# Altium schematic sheet 1Teclado_Prueba.SchDoc
size A4
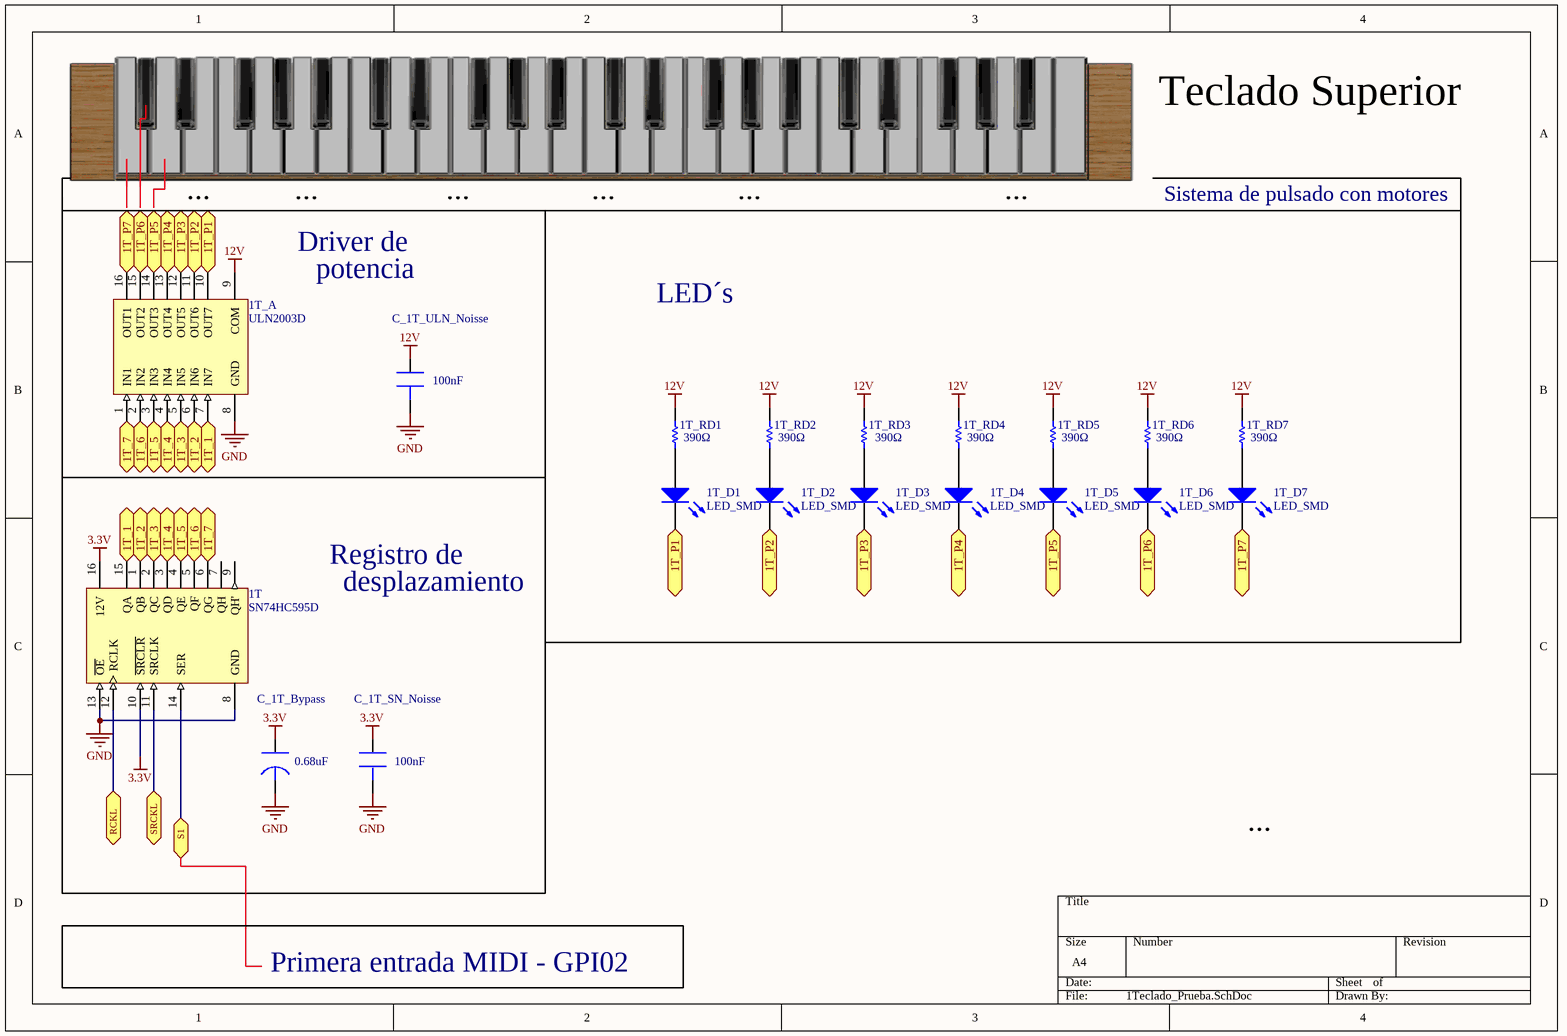
[diagram p0: 1Teclado_Prueba.SchDoc]

## Parts
1T  SN74HC595D  [SN74HC595D]
1T_A  ULN2003D  [ULN2003AI]
1T_D1  LED_SMD  [LED_0805]
1T_D2  LED_SMD  [LED_0805]
1T_D3  LED_SMD  [LED_0805]
1T_D4  LED_SMD  [LED_0805]
1T_D5  LED_SMD  [LED_0805]
1T_D6  LED_SMD  [LED_0805]
1T_D7  LED_SMD  [LED_0805]
1T_RD1  value 390Ω  [Resistencia_0805_N]  (hidden comment: Res Chip 0805)
1T_RD2  value 390Ω  [Resistencia_0805_N]  (hidden comment: Res Chip 0805)
1T_RD3  value 390Ω  [Resistencia_0805_N]  (hidden comment: Res Chip 0805)
1T_RD4  value 390Ω  [Resistencia_0805_N]  (hidden comment: Res Chip 0805)
1T_RD5  value 390Ω  [Resistencia_0805_N]  (hidden comment: Res Chip 0805)
1T_RD6  value 390Ω  [Resistencia_0805_N]  (hidden comment: Res Chip 0805)
1T_RD7  value 390Ω  [Resistencia_0805_N]  (hidden comment: Res Chip 0805)
C_1T_Bypass  value 0.68uF  [Panasonic B Size]  (hidden comment: Panasonic 1uF)
C_1T_SN_Noisse  value 100nF  [AVX Carcasa 1.206]  (hidden comment: AVX 100nF)
C_1T_ULN_Noisse  value 100nF  [AVX Carcasa 1.206]  (hidden comment: AVX 100nF)

## Ports
1T_1, 1T_2, 1T_3, 1T_4, 1T_5, 1T_6, 1T_7, 1T_P1, 1T_P2, 1T_P3, 1T_P4, 1T_P5, 1T_P6, 1T_P7, RCKL, S1, SRCKL

## Nets
3.3V: 1T.10(~{SRCLR}) 1T.16(12V) C_1T_Bypass.1 C_1T_SN_Noisse.1
12V: 1T_A.9(COM) 1T_RD1.2 1T_RD2.2 1T_RD3.2 1T_RD4.2 1T_RD5.2 1T_RD6.2 1T_RD7.2 C_1T_ULN_Noisse.1
GND: 1T.8(GND) 1T.13(~{OE}) 1T_A.8(GND) C_1T_Bypass.2 C_1T_SN_Noisse.2 C_1T_ULN_Noisse.2
1T_1: 1T.15(QA) 1T_A.7(IN7) ; port 1T_1
1T_2: 1T.1(QB) 1T_A.6(IN6) ; port 1T_2
1T_3: 1T.2(QC) 1T_A.5(IN5) ; port 1T_3
1T_4: 1T.3(QD) 1T_A.4(IN4) ; port 1T_4
1T_5: 1T.4(QE) 1T_A.3(IN3) ; port 1T_5
1T_6: 1T.5(QF) 1T_A.2(IN2) ; port 1T_6
1T_7: 1T.6(QG) 1T_A.1(IN1) ; port 1T_7
1T_P1: 1T_A.10(OUT7) 1T_D1.2(K) ; port 1T_P1
1T_P2: 1T_A.11(OUT6) 1T_D2.2(K) ; port 1T_P2
1T_P3: 1T_A.12(OUT5) 1T_D3.2(K) ; port 1T_P3
1T_P4: 1T_A.13(OUT4) 1T_D4.2(K) ; port 1T_P4
1T_P5: 1T_A.14(OUT3) 1T_D5.2(K) ; port 1T_P5
1T_P6: 1T_A.15(OUT2) 1T_D6.2(K) ; port 1T_P6
1T_P7: 1T_A.16(OUT1) 1T_D7.2(K) ; port 1T_P7
RCKL: 1T.12(RCLK) ; port RCKL
S1: 1T.14(SER) ; port S1
SRCKL: 1T.11(SRCLK) ; port SRCKL
Net1T_D1_1: 1T_D1.1(A) 1T_RD1.1
Net1T_D2_1: 1T_D2.1(A) 1T_RD2.1
Net1T_D3_1: 1T_D3.1(A) 1T_RD3.1
Net1T_D4_1: 1T_D4.1(A) 1T_RD4.1
Net1T_D5_1: 1T_D5.1(A) 1T_RD5.1
Net1T_D6_1: 1T_D6.1(A) 1T_RD6.1
Net1T_D7_1: 1T_D7.1(A) 1T_RD7.1

Not connected (* = marked no-connect by the designer): 1T 7(QH) 9(QH')

## Notes on the sheet
- Teclado Superior
- ...
- Sistema de pulsado con motores
- Driver de
- potencia
- LED´s
- Registro de
- desplazamiento
- Primera entrada MIDI - GPI02

## Library data of the parts
1T = SN74HC595D: 8-Bit Shift Register with 3-State Output Registers; Published: 8-Jun-2000; LatestRevisionDate: 13-Apr-2006; LatestRevisionNote: IPC-7351 Footprint Added.; DatasheetVersion: May-1997; PackageVersion: Jan-1998; PackageReference: D016; Publisher: Altium Limited; PackageDescription: 16-Pin Small Outline Integrated Circuit 1.27 mm Pitch; Code_IPC: SOIC127P600-16; ComponentLink1Description: Manufacturer Link; ComponentLink1URL: http://www.ti.com/; ComponentLink2Description: Datasheet; ComponentLink2URL: http://www-s.ti.com/sc/ds/sn74hc595.pdf
1T_A = ULN2003D: Seven Darlington Array; Published: 8-Jun-2000; LatestRevisionDate: 13-Apr-2006; LatestRevisionNote: IPC-7351 Footprint Added.; DatasheetVersion: Sep-1998; PackageVersion: May-1998; PackageReference: SO16; Publisher: Altium Limited; PackageDescription: 16-Pin Small Outline Integrated Circuit 1.27 mm Pitch; Code_IPC: SOIC127P600-16; ComponentLink1Description: Manufacturer Link; ComponentLink1URL: http://www.st.com/; ComponentLink2Description: Datasheet; ComponentLink2URL: http://www.st.com/stonline/products/literature/ds/5279/uln2001.pdf
1T_D1-1T_D7 = LED_SMD: LED SMD; Published: 8-Jun-2000; LatestRevisionDate: 08-Jul-2005; LatestRevisionNote: Mech Layer 1 removed.; PackageReference: LED-0; Publisher: Altium Limited
1T_RD1-1T_RD7 = Resistencia: Published: 8-Jun-2000; LatestRevisionDate: 17-Jul-2002; LatestRevisionNote: Re-released for DXP Platform.; PackageReference: AXIAL-0.3; Publisher: Altium Limited; PackageDescription: Axial Device, Thru-Hole; 2 Leads; 0.3 in Pin Spacing
C_1T_Bypass = Panasonic 1uF: Condensador Electrolítico SMD; Manufacturer #1: Nippon Chemi-Con; Part Number: EMV-500ADA101MJA0G; Tolerance: 20%; Ref. Mafero: 230; Voltage Rating: 50V; PCB DECAL: Panasonic B; Author: Jaime Jiménez Ortega; Cost: 0,718€; Date: 21/05/2009; Distributor: RS; Ref Distributor: 5479063
C_1T_SN_Noisse C_1T_ULN_Noisse = AVX 100nF: Condensador Cerámico SMD; Manufacturer #1: Nippon Chemi-Con; Part Number: EMV-500ADA101MJA0G; Tolerance: 20%; Ref. Mafero: 230; Voltage Rating: 50V; Author: Jaime Jiménez Ortega; Cost: 0,718€; Date: 21/05/2009; Distributor: RS; Ref Distributor: 5479063; PCB DECAL: AVX 1206